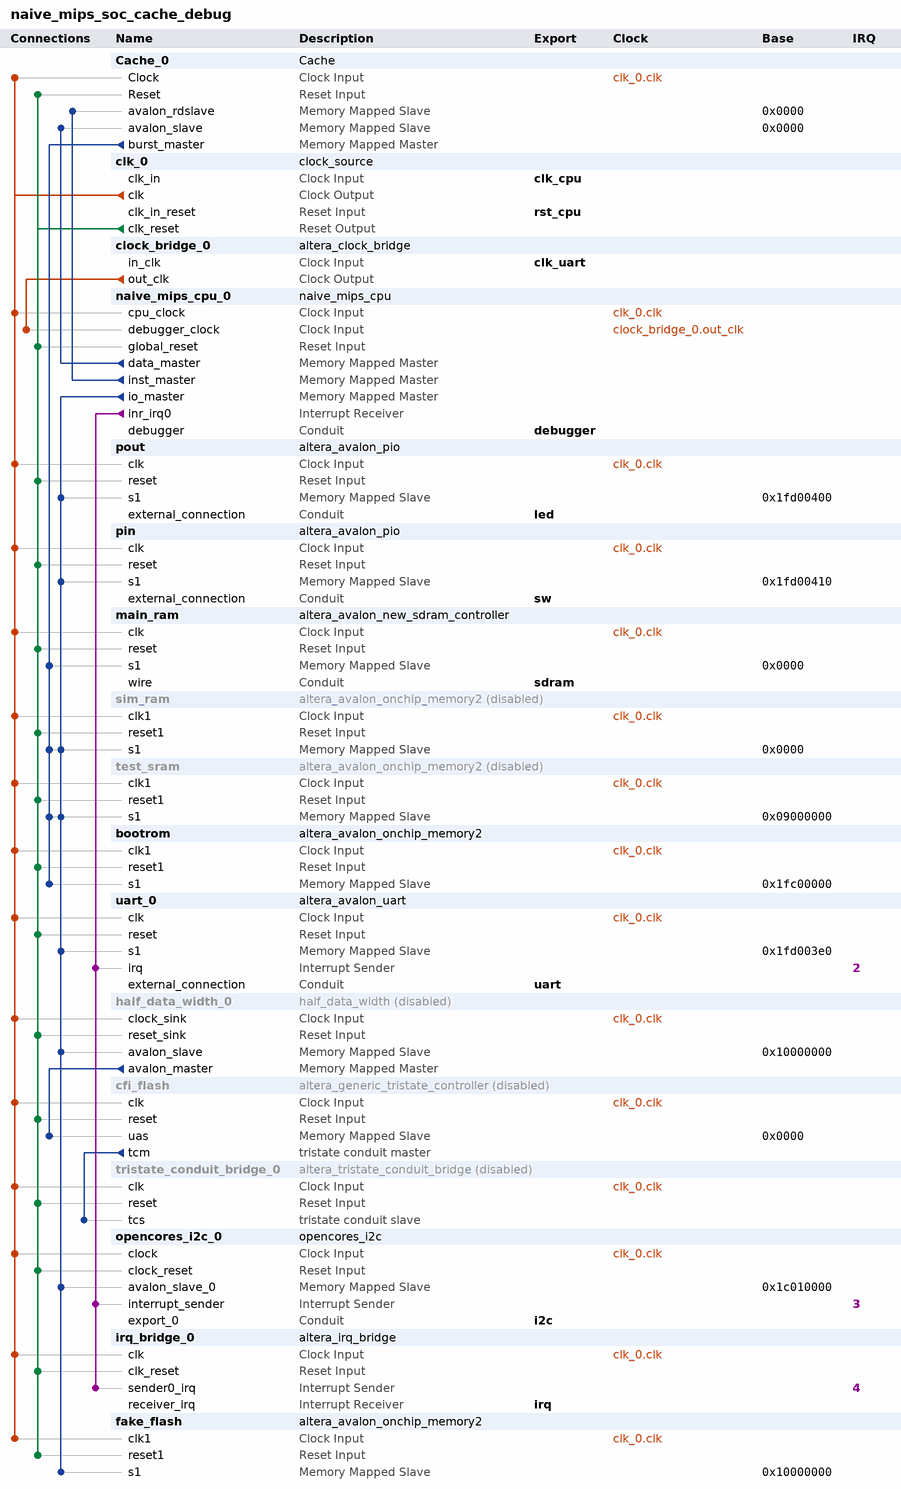
[diagram p0: system contents]
# Platform Designer (Qsys) system naive_mips_soc_cache_debug, Cyclone IV GX EP4CGX150DF31C8
# Parameters at their usual value, and those the tool derives, are not listed.
package require -exact qsys 15.1
create_system naive_mips_soc_cache_debug
set_project_property DEVICE_FAMILY {Cyclone IV GX}
set_project_property DEVICE EP4CGX150DF31C8

add_instance Cache_0 Cache 1.0
set_instance_parameter_value Cache_0 ADDR_WIDTH 32
set_instance_parameter_value Cache_0 CACHE_LINE_WIDTH 4
set_instance_parameter_value Cache_0 TAG_WIDTH 24

add_instance clk_0 clock_source 15.1
set_instance_parameter_value clk_0 clockFrequency 30000000
set_instance_parameter_value clk_0 resetSynchronousEdges DEASSERT

add_instance clock_bridge_0 altera_clock_bridge 15.1
set_instance_parameter_value clock_bridge_0 DERIVED_CLOCK_RATE 0
set_instance_parameter_value clock_bridge_0 EXPLICIT_CLOCK_RATE 0

add_instance naive_mips_cpu_0 naive_mips_cpu 1.0

add_instance pout altera_avalon_pio 15.1
set_instance_parameter_value pout direction Output
set_instance_parameter_value pout width 32

add_instance pin altera_avalon_pio 15.1
set_instance_parameter_value pin direction Input
set_instance_parameter_value pin simDoTestBenchWiring true
set_instance_parameter_value pin simDrivenValue 1
set_instance_parameter_value pin width 32

add_instance main_ram altera_avalon_new_sdram_controller 15.1
set_instance_parameter_value main_ram TAC 5.5
set_instance_parameter_value main_ram TRCD 20.0
set_instance_parameter_value main_ram TRP 20.0
set_instance_parameter_value main_ram casLatency 3
set_instance_parameter_value main_ram columnWidth 10
set_instance_parameter_value main_ram dataWidth 32
set_instance_parameter_value main_ram generateSimulationModel true
set_instance_parameter_value main_ram model single_Micron_MT48LC4M32B2_7_chip
set_instance_parameter_value main_ram numberOfBanks 4
set_instance_parameter_value main_ram numberOfChipSelects 1
set_instance_parameter_value main_ram powerUpDelay 0.1
set_instance_parameter_value main_ram refreshPeriod 15.625
set_instance_parameter_value main_ram rowWidth 13

add_instance sim_ram altera_avalon_onchip_memory2 15.1
set_instance_property sim_ram ENABLED false
set_instance_parameter_value sim_ram dataWidth 32
set_instance_parameter_value sim_ram dualPort false
set_instance_parameter_value sim_ram initMemContent false
set_instance_parameter_value sim_ram initializationFileName onchip_mem.hex
set_instance_parameter_value sim_ram memorySize 1048576
set_instance_parameter_value sim_ram resetrequest_enabled false

add_instance test_sram altera_avalon_onchip_memory2 15.1
set_instance_property test_sram ENABLED false
set_instance_parameter_value test_sram allowInSystemMemoryContentEditor true
set_instance_parameter_value test_sram dataWidth 32
set_instance_parameter_value test_sram dualPort false
set_instance_parameter_value test_sram initMemContent true
set_instance_parameter_value test_sram initializationFileName onchip_mem.hex
set_instance_parameter_value test_sram instanceID TRAM
set_instance_parameter_value test_sram memorySize 16384

add_instance bootrom altera_avalon_onchip_memory2 15.1
set_instance_parameter_value bootrom allowInSystemMemoryContentEditor true
set_instance_parameter_value bootrom dataWidth 32
set_instance_parameter_value bootrom dualPort false
set_instance_parameter_value bootrom initMemContent true
set_instance_parameter_value bootrom initializationFileName E:/Projects/NaiveMIPS-HDL/altera/bootrom.mif
set_instance_parameter_value bootrom instanceID BOOT
set_instance_parameter_value bootrom memorySize 8192
set_instance_parameter_value bootrom resetrequest_enabled false
set_instance_parameter_value bootrom useNonDefaultInitFile true
set_instance_parameter_value bootrom writable false

add_instance uart_0 altera_avalon_uart 15.1
set_instance_parameter_value uart_0 baud 115200
set_instance_parameter_value uart_0 dataBits 8
set_instance_parameter_value uart_0 fixedBaud true
set_instance_parameter_value uart_0 parity NONE
set_instance_parameter_value uart_0 stopBits 1

add_instance half_data_width_0 half_data_width 1.0
set_instance_property half_data_width_0 ENABLED false

add_instance cfi_flash altera_generic_tristate_controller 15.1
set_instance_property cfi_flash ENABLED false
set_instance_parameter_value cfi_flash ACTIVE_LOW_BEGINTRANSFER 0
set_instance_parameter_value cfi_flash ACTIVE_LOW_BYTEENABLE 0
set_instance_parameter_value cfi_flash ACTIVE_LOW_OUTPUTENABLE 0
set_instance_parameter_value cfi_flash ACTIVE_LOW_READ 1
set_instance_parameter_value cfi_flash ACTIVE_LOW_RESET_OUTPUT 1
set_instance_parameter_value cfi_flash CHIPSELECT_THROUGH_READLATENCY 0
set_instance_parameter_value cfi_flash IS_MEMORY_DEVICE 0
set_instance_parameter_value cfi_flash MODULE_ASSIGNMENT_KEYS embeddedsw.configuration.hwClassnameDriverSupportList,embeddedsw.configuration.hwClassnameDriverSupportDefault,embeddedsw.CMacro.SETUP_VALUE,embeddedsw.CMacro.WAIT_VALUE,embeddedsw.CMacro.HOLD_VALUE,embeddedsw.CMacro.TIMING_UNITS,embeddedsw.CMacro.SIZE,embeddedsw.memoryInfo.MEM_INIT_DATA_WIDTH,embeddedsw.memoryInfo.HAS_BYTE_LANE,embeddedsw.memoryInfo.IS_FLASH,embeddedsw.memoryInfo.GENERATE_DAT_SYM,embeddedsw.memoryInfo.GENERATE_FLASH,embeddedsw.memoryInfo.DAT_SYM_INSTALL_DIR,embeddedsw.memoryInfo.FLASH_INSTALL_DIR
set_instance_parameter_value cfi_flash MODULE_ASSIGNMENT_VALUES altera_avalon_lan91c111:altera_avalon_cfi_flash,altera_avalon_cfi_flash,0,0,0,ns,262144u,8,0,1,1,1,SIM_DIR,APP_DIR
set_instance_parameter_value cfi_flash TCM_ADDRESS_W 26
set_instance_parameter_value cfi_flash TCM_BYTEENABLE_W 2
set_instance_parameter_value cfi_flash TCM_DATA_HOLD 60
set_instance_parameter_value cfi_flash TCM_DATA_W 16
set_instance_parameter_value cfi_flash TCM_MAX_PENDING_READ_TRANSACTIONS 3
set_instance_parameter_value cfi_flash TCM_READLATENCY 2
set_instance_parameter_value cfi_flash TCM_READ_WAIT 160
set_instance_parameter_value cfi_flash TCM_SETUP_WAIT 60
set_instance_parameter_value cfi_flash TCM_SYMBOLS_PER_WORD 2
set_instance_parameter_value cfi_flash TCM_TIMING_UNITS 0
set_instance_parameter_value cfi_flash TCM_TURNAROUND_TIME 2
set_instance_parameter_value cfi_flash TCM_WRITE_WAIT 160
set_instance_parameter_value cfi_flash USE_BEGINTRANSFER 0
set_instance_parameter_value cfi_flash USE_BYTEENABLE 0
set_instance_parameter_value cfi_flash USE_OUTPUTENABLE 0
set_instance_parameter_value cfi_flash USE_READ 1
set_instance_parameter_value cfi_flash USE_RESET_OUTPUT 1

add_instance tristate_conduit_bridge_0 altera_tristate_conduit_bridge 15.1
set_instance_property tristate_conduit_bridge_0 ENABLED false

add_instance opencores_i2c_0 opencores_i2c 9.1

add_instance irq_bridge_0 altera_irq_bridge 15.1
set_instance_parameter_value irq_bridge_0 IRQ_WIDTH 1

add_instance fake_flash altera_avalon_onchip_memory2 15.1
set_instance_parameter_value fake_flash dataWidth 32
set_instance_parameter_value fake_flash dualPort false
set_instance_parameter_value fake_flash initMemContent true
set_instance_parameter_value fake_flash initializationFileName E:/Projects/NaiveMIPS-HDL/altera/flash.hex
set_instance_parameter_value fake_flash memorySize 8388608
set_instance_parameter_value fake_flash resetrequest_enabled false
set_instance_parameter_value fake_flash useNonDefaultInitFile true
set_instance_parameter_value fake_flash writable false

# connections
add_connection clk_0.clk bootrom.clk1 clock
add_connection clk_0.clk Cache_0.Clock clock
add_connection clk_0.clk cfi_flash.clk clock
add_connection clk_0.clk fake_flash.clk1 clock
add_connection clk_0.clk half_data_width_0.clock_sink clock
add_connection clk_0.clk irq_bridge_0.clk clock
add_connection clk_0.clk main_ram.clk clock
add_connection clk_0.clk naive_mips_cpu_0.cpu_clock clock
add_connection clk_0.clk opencores_i2c_0.clock clock
add_connection clk_0.clk pin.clk clock
add_connection clk_0.clk pout.clk clock
add_connection clk_0.clk sim_ram.clk1 clock
add_connection clk_0.clk test_sram.clk1 clock
add_connection clk_0.clk tristate_conduit_bridge_0.clk clock
add_connection clk_0.clk uart_0.clk clock
add_connection clock_bridge_0.out_clk naive_mips_cpu_0.debugger_clock clock
add_connection clk_0.clk_reset bootrom.reset1 reset
add_connection clk_0.clk_reset Cache_0.Reset reset
add_connection clk_0.clk_reset cfi_flash.reset reset
add_connection clk_0.clk_reset fake_flash.reset1 reset
add_connection clk_0.clk_reset half_data_width_0.reset_sink reset
add_connection clk_0.clk_reset irq_bridge_0.clk_reset reset
add_connection clk_0.clk_reset main_ram.reset reset
add_connection clk_0.clk_reset naive_mips_cpu_0.global_reset reset
add_connection clk_0.clk_reset opencores_i2c_0.clock_reset reset
add_connection clk_0.clk_reset pin.reset reset
add_connection clk_0.clk_reset pout.reset reset
add_connection clk_0.clk_reset sim_ram.reset1 reset
add_connection clk_0.clk_reset test_sram.reset1 reset
add_connection clk_0.clk_reset tristate_conduit_bridge_0.reset reset
add_connection clk_0.clk_reset uart_0.reset reset
add_connection Cache_0.burst_master bootrom.s1 avalon
set_connection_parameter_value Cache_0.burst_master/bootrom.s1 baseAddress 0x1fc00000
add_connection Cache_0.burst_master main_ram.s1 avalon
set_connection_parameter_value Cache_0.burst_master/main_ram.s1 baseAddress 0x0000
add_connection Cache_0.burst_master sim_ram.s1 avalon
set_connection_parameter_value Cache_0.burst_master/sim_ram.s1 baseAddress 0x0000
add_connection Cache_0.burst_master test_sram.s1 avalon
set_connection_parameter_value Cache_0.burst_master/test_sram.s1 baseAddress 0x09000000
add_connection half_data_width_0.avalon_master cfi_flash.uas avalon
set_connection_parameter_value half_data_width_0.avalon_master/cfi_flash.uas baseAddress 0x0000
add_connection naive_mips_cpu_0.data_master Cache_0.avalon_slave avalon
set_connection_parameter_value naive_mips_cpu_0.data_master/Cache_0.avalon_slave baseAddress 0x0000
add_connection naive_mips_cpu_0.inst_master Cache_0.avalon_rdslave avalon
set_connection_parameter_value naive_mips_cpu_0.inst_master/Cache_0.avalon_rdslave baseAddress 0x0000
add_connection naive_mips_cpu_0.io_master fake_flash.s1 avalon
set_connection_parameter_value naive_mips_cpu_0.io_master/fake_flash.s1 baseAddress 0x10000000
add_connection naive_mips_cpu_0.io_master half_data_width_0.avalon_slave avalon
set_connection_parameter_value naive_mips_cpu_0.io_master/half_data_width_0.avalon_slave baseAddress 0x10000000
add_connection naive_mips_cpu_0.io_master opencores_i2c_0.avalon_slave_0 avalon
set_connection_parameter_value naive_mips_cpu_0.io_master/opencores_i2c_0.avalon_slave_0 baseAddress 0x1c010000
add_connection naive_mips_cpu_0.io_master pin.s1 avalon
set_connection_parameter_value naive_mips_cpu_0.io_master/pin.s1 baseAddress 0x1fd00410
add_connection naive_mips_cpu_0.io_master pout.s1 avalon
set_connection_parameter_value naive_mips_cpu_0.io_master/pout.s1 baseAddress 0x1fd00400
add_connection naive_mips_cpu_0.io_master sim_ram.s1 avalon
set_connection_parameter_value naive_mips_cpu_0.io_master/sim_ram.s1 baseAddress 0x0000
add_connection naive_mips_cpu_0.io_master test_sram.s1 avalon
set_connection_parameter_value naive_mips_cpu_0.io_master/test_sram.s1 baseAddress 0x09000000
add_connection naive_mips_cpu_0.io_master uart_0.s1 avalon
set_connection_parameter_value naive_mips_cpu_0.io_master/uart_0.s1 baseAddress 0x1fd003e0
add_connection naive_mips_cpu_0.inr_irq0 irq_bridge_0.sender0_irq interrupt
set_connection_parameter_value naive_mips_cpu_0.inr_irq0/irq_bridge_0.sender0_irq irqNumber 4
add_connection naive_mips_cpu_0.inr_irq0 opencores_i2c_0.interrupt_sender interrupt
set_connection_parameter_value naive_mips_cpu_0.inr_irq0/opencores_i2c_0.interrupt_sender irqNumber 3
add_connection naive_mips_cpu_0.inr_irq0 uart_0.irq interrupt
set_connection_parameter_value naive_mips_cpu_0.inr_irq0/uart_0.irq irqNumber 2
add_connection cfi_flash.tcm tristate_conduit_bridge_0.tcs tristate_conduit

# exported interfaces
add_interface clk_cpu clock sink
set_interface_property clk_cpu EXPORT_OF clk_0.clk_in
add_interface clk_uart clock sink
set_interface_property clk_uart EXPORT_OF clock_bridge_0.in_clk
add_interface debugger conduit end
set_interface_property debugger EXPORT_OF naive_mips_cpu_0.debugger
add_interface i2c conduit end
set_interface_property i2c EXPORT_OF opencores_i2c_0.export_0
add_interface irq interrupt receiver
set_interface_property irq EXPORT_OF irq_bridge_0.receiver_irq
add_interface led conduit end
set_interface_property led EXPORT_OF pout.external_connection
add_interface rst_cpu reset sink
set_interface_property rst_cpu EXPORT_OF clk_0.clk_in_reset
add_interface sdram conduit end
set_interface_property sdram EXPORT_OF main_ram.wire
add_interface sw conduit end
set_interface_property sw EXPORT_OF pin.external_connection
add_interface uart conduit end
set_interface_property uart EXPORT_OF uart_0.external_connection

set_interconnect_requirement {$system} qsys_mm.clockCrossingAdapter HANDSHAKE
set_interconnect_requirement {$system} qsys_mm.enableEccProtection FALSE
set_interconnect_requirement {$system} qsys_mm.insertDefaultSlave FALSE
set_interconnect_requirement {$system} qsys_mm.maxAdditionalLatency 1

save_system naive_mips_soc_cache_debug.qsys
